# EAGLE schematic falownik (2) (EAGLE 9.0.1)
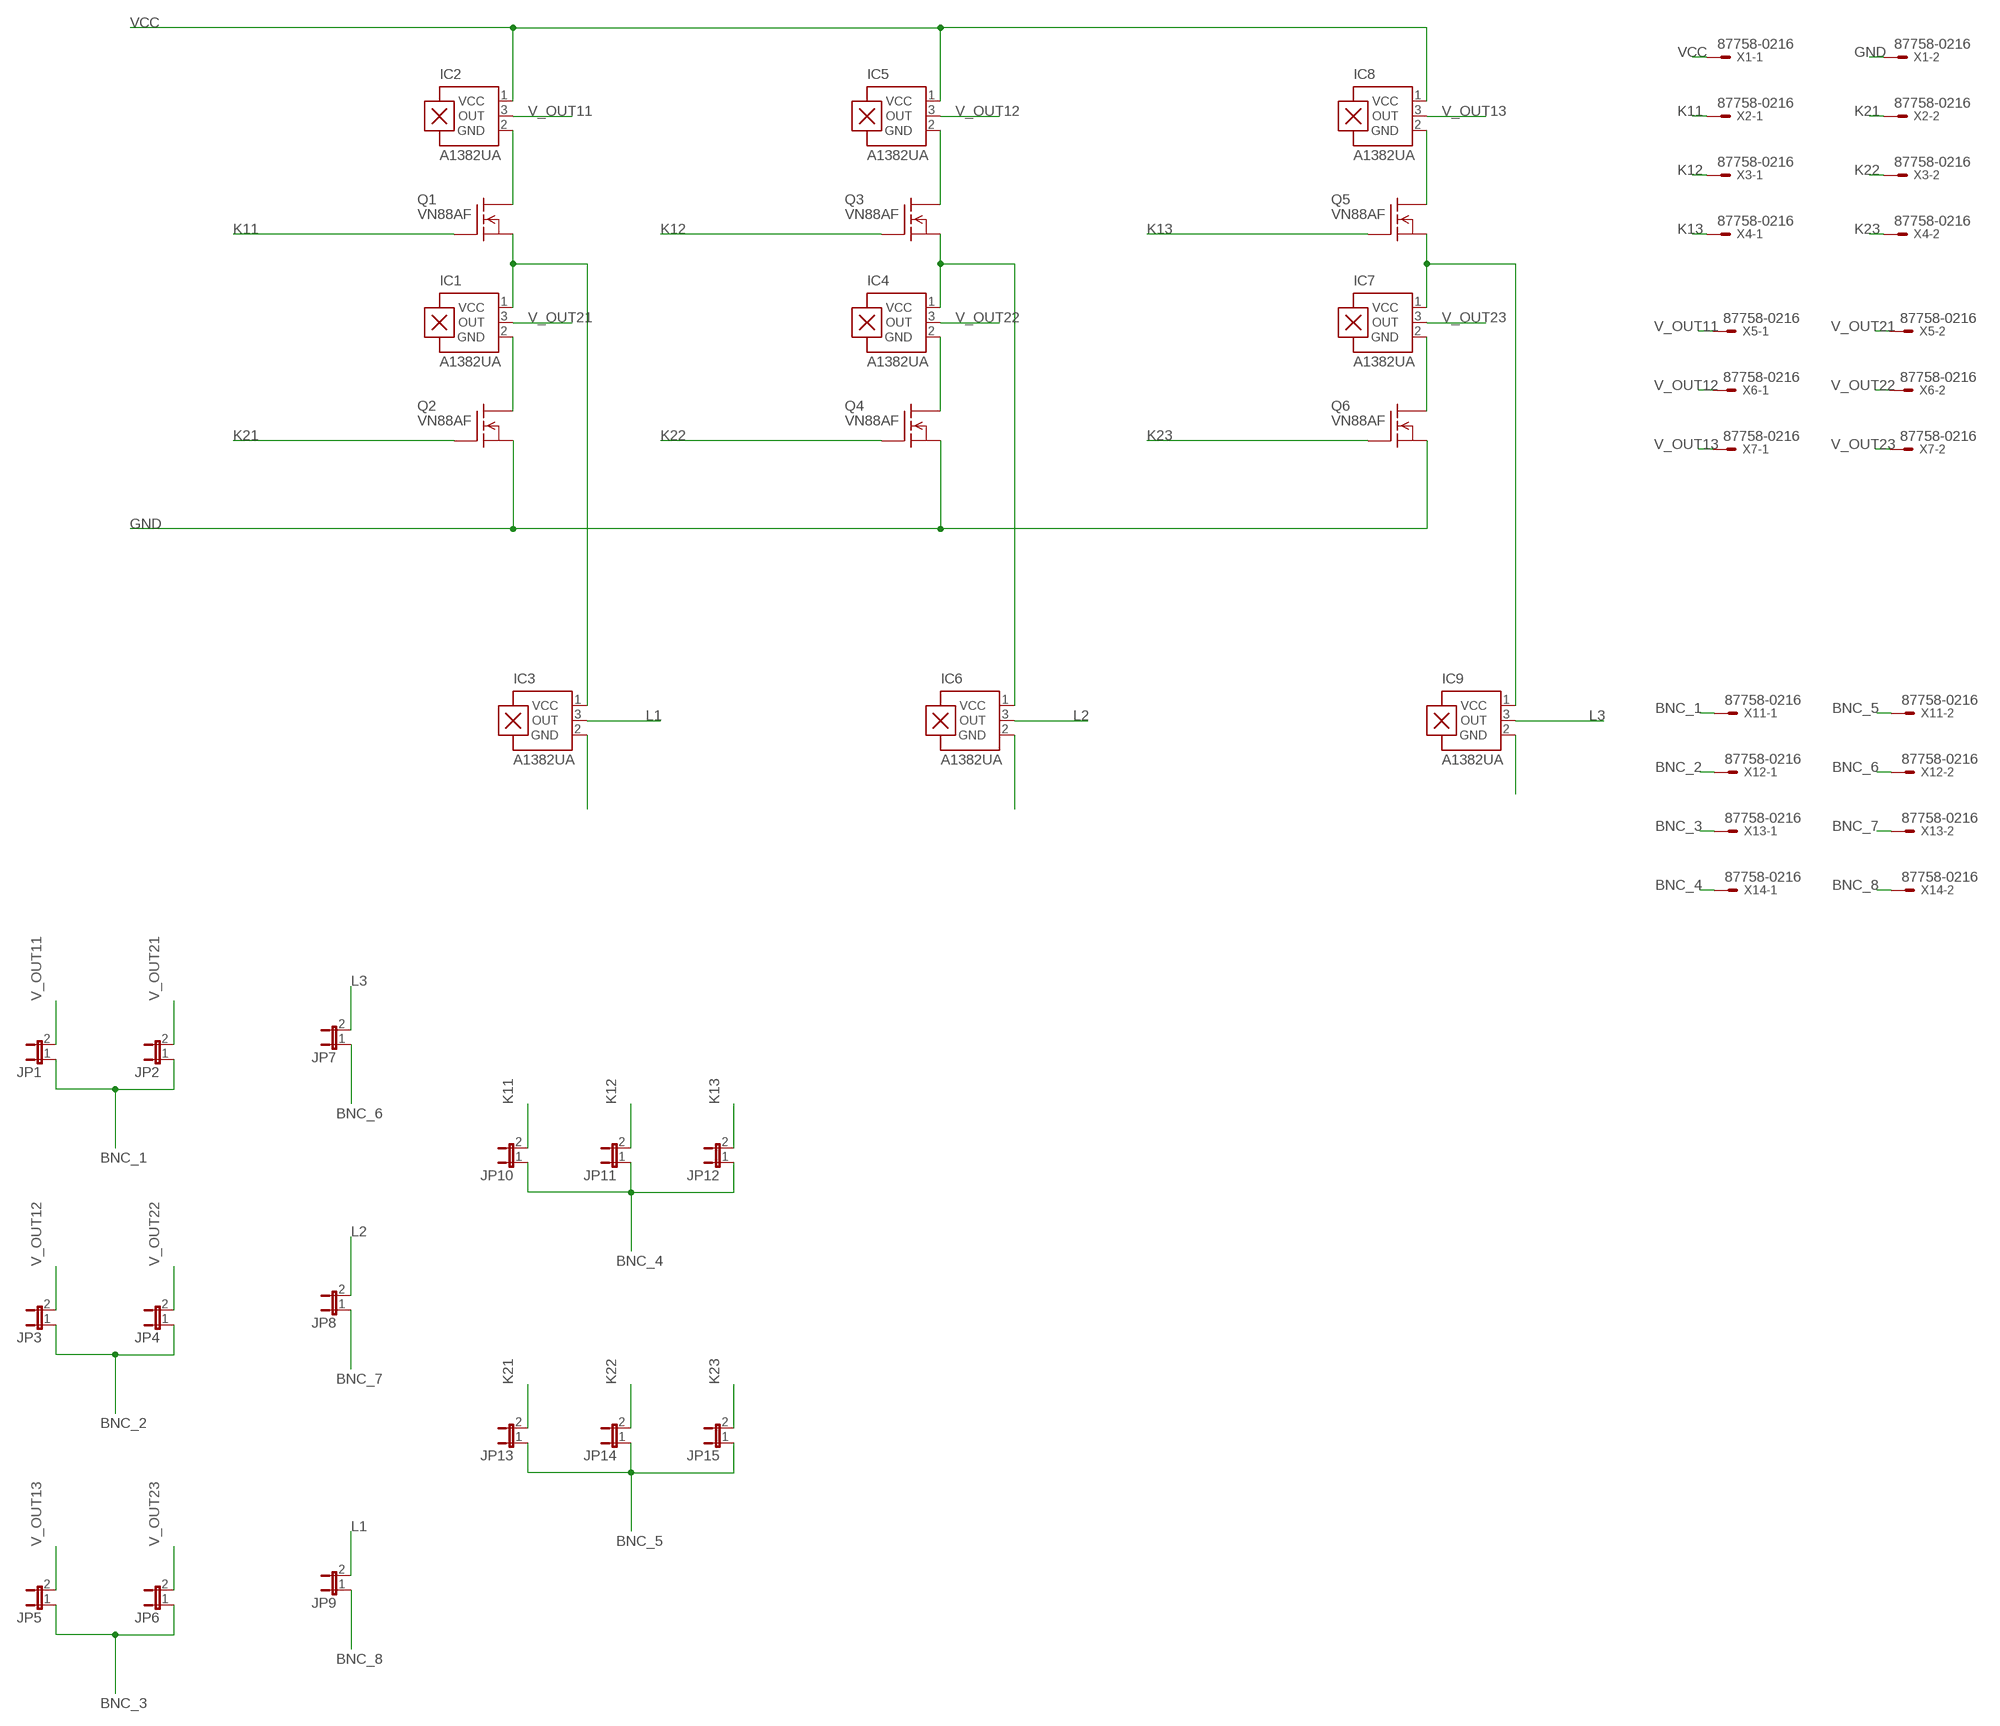
[diagram p0: schematic, sheet 1]

## Parts
IC1  A1382UA  [SIP3-UA]
IC2  A1382UA  [SIP3-UA]
IC3  A1382UA  [SIP3-UA]
IC4  A1382UA  [SIP3-UA]
IC5  A1382UA  [SIP3-UA]
IC6  A1382UA  [SIP3-UA]
IC7  A1382UA  [SIP3-UA]
IC8  A1382UA  [SIP3-UA]
IC9  A1382UA  [SIP3-UA]
JP1  JP1E  [JP1]
JP2  JP1E  [JP1]
JP3  JP1E  [JP1]
JP4  JP1E  [JP1]
JP5  JP1E  [JP1]
JP6  JP1E  [JP1]
JP7  JP1E  [JP1]
JP8  JP1E  [JP1]
JP9  JP1E  [JP1]
JP10  JP1E  [JP1]
JP11  JP1E  [JP1]
JP12  JP1E  [JP1]
JP13  JP1E  [JP1]
JP14  JP1E  [JP1]
JP15  JP1E  [JP1]
Q1  VN88AF  [TO202]
Q2  VN88AF  [TO202]
Q3  VN88AF  [TO202]
Q4  VN88AF  [TO202]
Q5  VN88AF  [TO202]
Q6  VN88AF  [TO202]
X1  87758-0216  [87758-0216]
X2  87758-0216  [87758-0216]
X3  87758-0216  [87758-0216]
X4  87758-0216  [87758-0216]
X5  87758-0216  [87758-0216]
X6  87758-0216  [87758-0216]
X7  87758-0216  [87758-0216]
X11  87758-0216  [87758-0216]
X12  87758-0216  [87758-0216]
X13  87758-0216  [87758-0216]
X14  87758-0216  [87758-0216]

## Nets
BNC_1: JP1.1 JP2.1 X11.1
BNC_2: JP3.1 JP4.1 X12.1
BNC_3: JP5.1 JP6.1 X13.1
BNC_4: JP10.1 JP11.1 JP12.1 X14.1
BNC_5: JP13.1 JP14.1 JP15.1 X11.2
BNC_6: JP7.1 X12.2
BNC_7: JP8.1 X13.2
BNC_8: JP9.1 X14.2
GND: Q2.1(S) Q4.1(S) Q6.1(S) X1.2
K11: JP10.2 Q1.2(G) X2.1
K12: JP11.2 Q3.2(G) X3.1
K13: JP12.2 Q5.2(G) X4.1
K21: JP13.2 Q2.2(G) X2.2
K22: JP14.2 Q4.2(G) X3.2
K23: JP15.2 Q6.2(G) X4.2
L1: IC3.3(OUT) JP9.2
L2: IC6.3(OUT) JP8.2
L3: IC9.3(OUT) JP7.2
N$1: IC2.2(GND) Q1.3(D)
N$2: IC3.2(GND)
N$3: IC1.2(GND) Q2.3(D)
N$4: IC1.1(VCC) IC3.1(VCC) Q1.1(S)
N$5: IC6.2(GND)
N$6: IC9.2(GND)
N$12: IC5.2(GND) Q3.3(D)
N$14: IC4.2(GND) Q4.3(D)
N$15: IC4.1(VCC) IC6.1(VCC) Q3.1(S)
N$23: IC8.2(GND) Q5.3(D)
N$25: IC7.2(GND) Q6.3(D)
N$26: IC7.1(VCC) IC9.1(VCC) Q5.1(S)
V_OUT11: IC2.3(OUT) JP1.2 X5.1
V_OUT12: IC5.3(OUT) JP3.2 X6.1
V_OUT13: IC8.3(OUT) JP5.2 X7.1
V_OUT21: IC1.3(OUT) JP2.2 X5.2
V_OUT22: IC4.3(OUT) JP4.2 X6.2
V_OUT23: IC7.3(OUT) JP6.2 X7.2
VCC: IC2.1(VCC) IC5.1(VCC) IC8.1(VCC) X1.1

## Library data of the parts
IC1-IC9 = allegro:A13*?: Linear Hall Effect Sensor ICs Continuous-Time Ratiometric High-Temperature Operation Programmable Linear with Analog Output A1302 -Replacement- UGN3503 Source: http://www.allegromicro.com/en/Products/Part_Numbers/1301/1301.pdf http://www.allegromicro.com/en/Products/Part_Numbers/1321/1321.pdf http://www.allegromicro.com/en/Products/Part_Numbers/1381/1381.pdf; MPN: A1382LUA-T; OC_FARNELL: unknown; OC_NEWARK: 30M9953
JP1-JP15 = jumper:JP1E: JUMPER
Q1-Q6 = transistor-fet:VN88AF: N-Channel Enhancement MOSFET 80V; 2A; 3,0Ohm
X1-X7 X11-X14 = con-molex:87758-0216: 2 Pin - 2mm Dual Row Single Wafer, Vertical T/H HDR Source: http://www.molex.com/pdm_docs/sd/877580616_sd.pdf; MF: MOLEX; MPN: 87758-0216; OC_FARNELL: unknown; OC_NEWARK: 94M1513